# Altium project ShinStrap_V1.PrjPcb
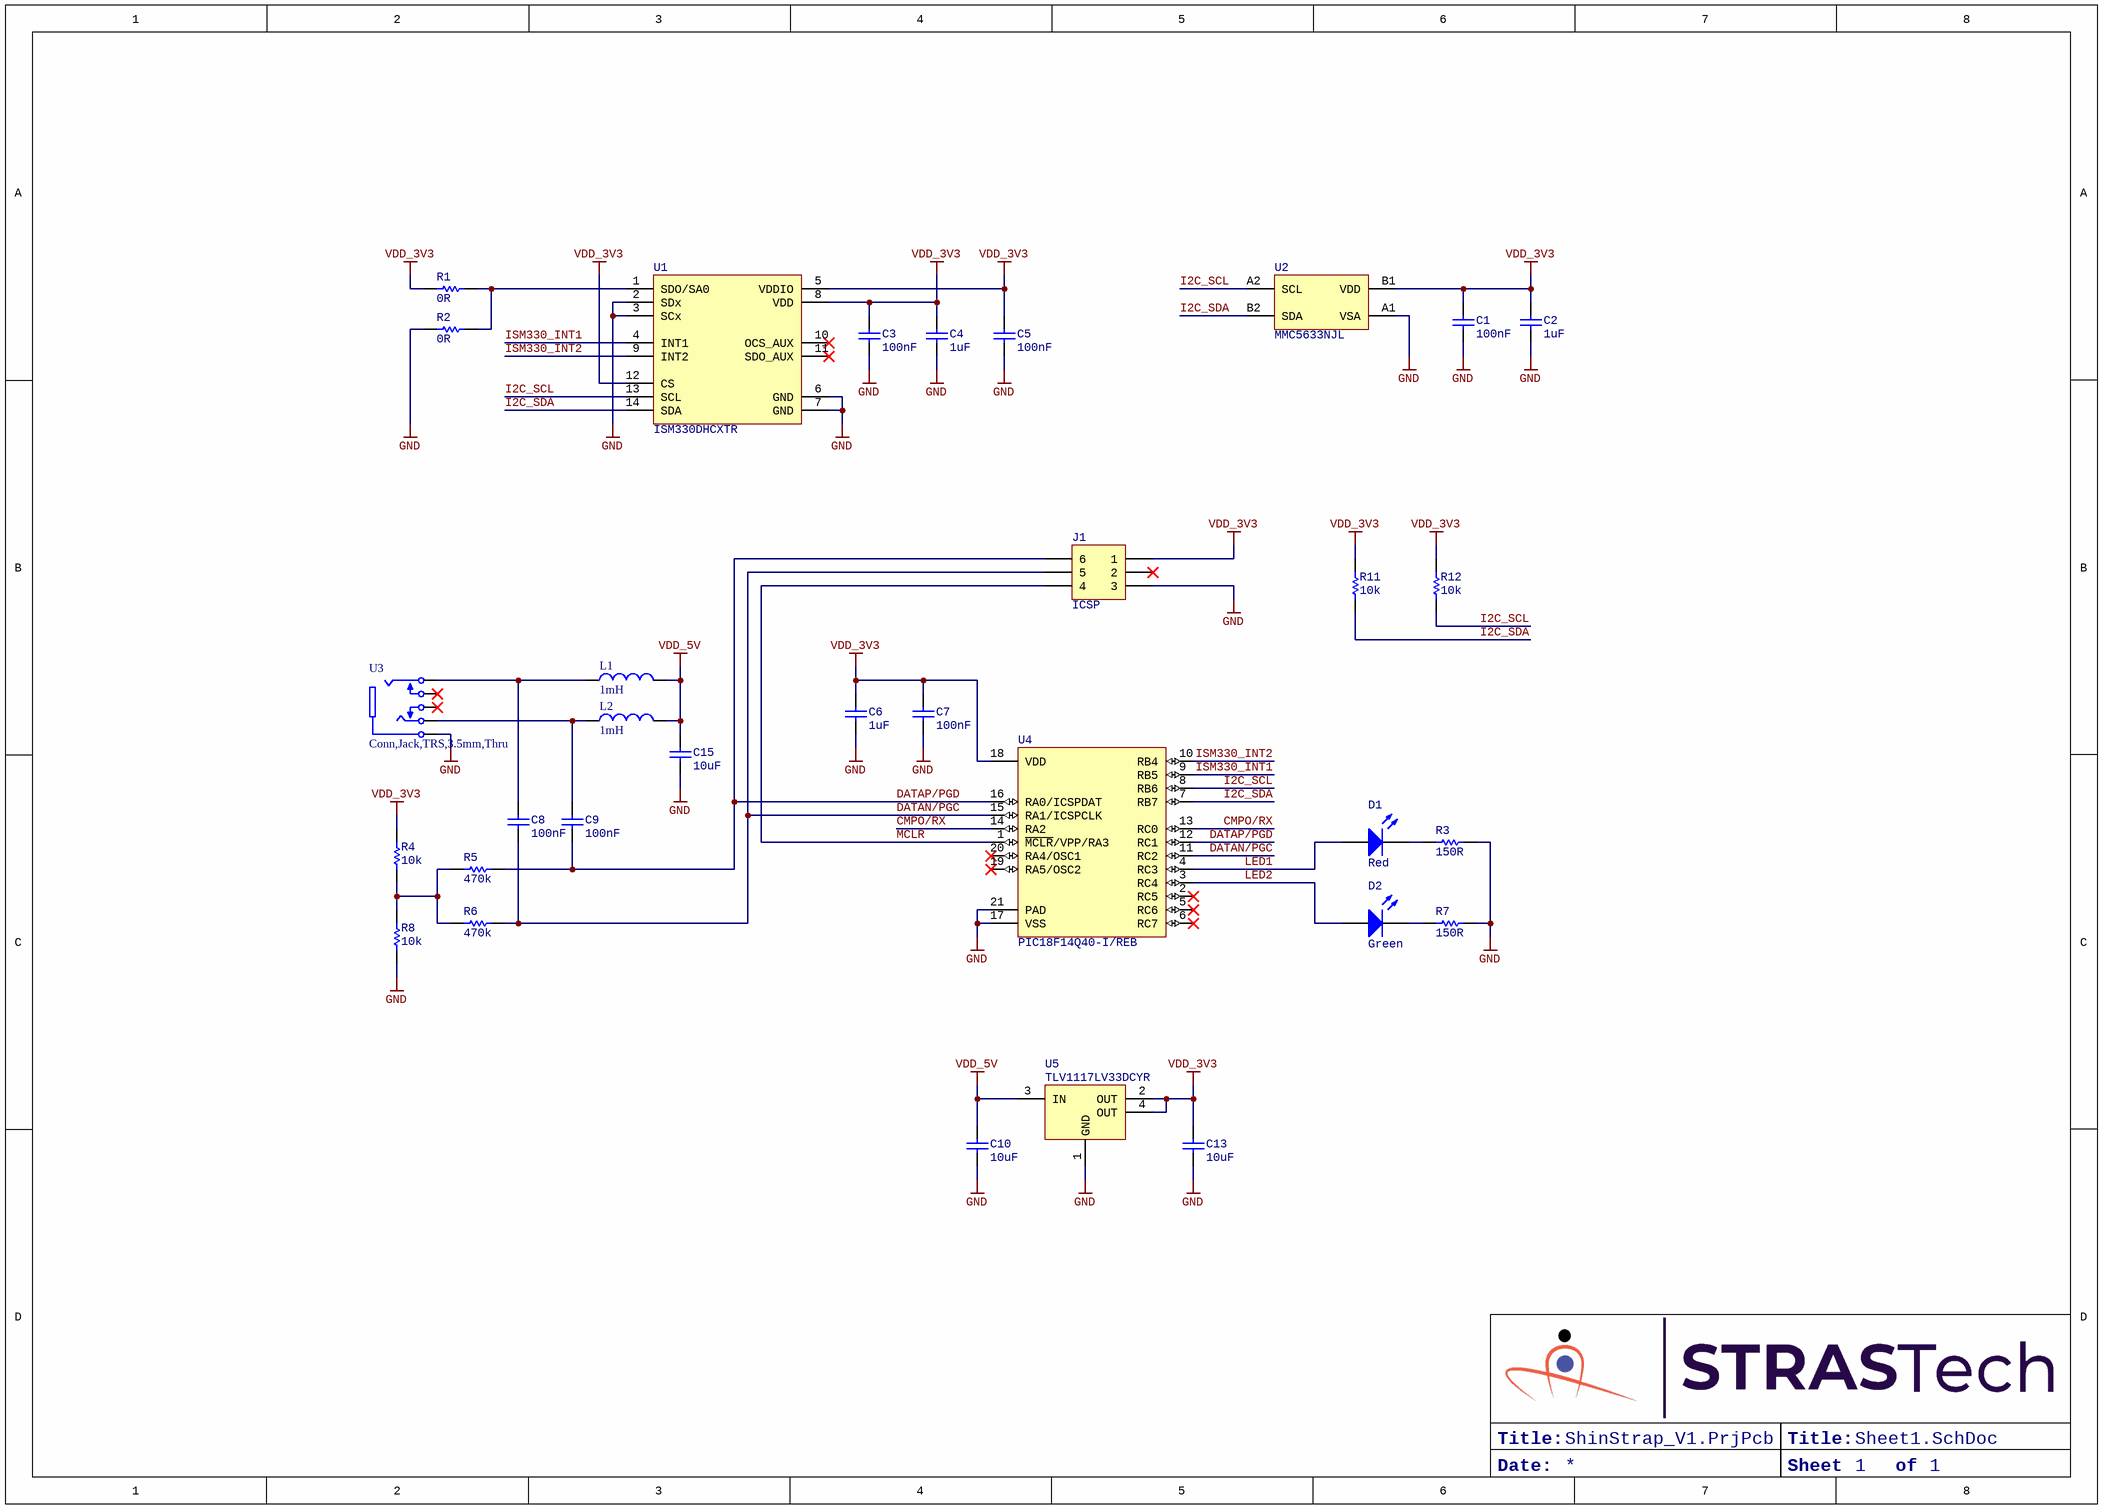
[diagram p0: Sheet1.SchDoc]
1 sheet, 32 parts. Net scope: global (net labels, ports and power ports of the same name join across sheets).
Board file: PCB1.PcbDoc

## Sheet Sheet1.SchDoc
size A3; Organization: Altium Limited; Address1: L3, 12a Rodborough Rd; Address2: Frenchs Forest; Address3: NSW; Address4: Australia 2086; SheetNumber: 1; SheetTotal: 1

### Parts
C1  100nF  [Cap,SMD,0402]
C2  1uF  [Cap,SMD,0402]
C3  100nF  [Cap,SMD,0402]
C4  1uF  [Cap,SMD,0402]
C5  100nF  [Cap,SMD,0402]
C6  1uF  [Cap,SMD,0402]
C7  100nF  [Cap,SMD,0402]
C8  100nF  [Cap,SMD,0402]
C9  100nF  [Cap,SMD,0402]
C10  10uF  [Cap,SMD,0402]
C13  10uF  [Cap,SMD,0402]
C15  10uF  [Cap,SMD,0402]
D1  Red  [LED,0603]
D2  Green  [LED,0603]
J1  Term,Header,3x2 Pin,1.27mm,SMD  [TERM,HEADER,3X2PIN,P1.27,SMD]  (value not drawn)
L1  1mH  [IND,1210]
L2  1mH  [IND,1210]
R1  0R  [RES,0402]
R2  0R  [RES,0402]
R3  150R  [RES,0402]
R4  10k  [RES,0402]
R5  470k  [RES,0402]
R6  470k  [RES,0402]
R7  150R  [RES,0402]
R8  10k  [RES,0402]
R11  10k  [RES,0402]
R12  10k  [RES,0402]
U1  ISM330DHCXTR  [IC,LGA-14L,2.5x3mm]
U2  MMC5633NJL  [IC,WLP,2x2,P0.4mm]
U3  Conn,Jack,TRS,3.5mm,Thru  [CONN,JACK,TRS,3.5MM,THRU]
U4  PIC18F14Q40-I/REB  [IC,QFN-20,3x3,PAD,P0.4]
U5  TLV1117LV33DCYR  [SOT223]

### Nets
GND: C1.2 C2.1 C3.1 C4.1 C5.1 C6.1 C7.1 C10.1 C13.1 C15.1 J1.3 R2.1 R3.2 R7.2 R8.1 U1.2(SDx) U1.3(SCx) U1.6(GND) U1.7(GND) U2.A1(VSA) U3.1(S) U4.17(VSS) U4.21(PAD) U5.1(GND)
VDD_3V3: C1.1 C2.2 C3.2 C4.2 C5.2 C6.2 C7.2 C13.2 J1.1 R1.1 R4.2 R11.2 R12.2 U1.5(VDDIO) U1.8(VDD) U1.12(CS) U2.B1(VDD) U4.18(VDD) U5.2(OUT) U5.4(OUT)
VDD_5V: C10.2 C15.2 L1.2 L2.2 U5.3(IN)
CMPO/RX: U4.13(RC0) U4.14(RA2)
DATAN/PGC: C8.1 J1.5 R6.1 U4.11(RC2) U4.15(RA1/ICSPCLK)
DATAP/PGD: C9.1 J1.6 R5.1 U4.12(RC1) U4.16(RA0/ICSPDAT)
I2C_SCL: R12.1 U1.13(SCL) U2.A2(SCL) U4.8(RB6)
I2C_SDA: R11.1 U1.14(SDA) U2.B2(SDA) U4.7(RB7)
ISM330_INT1: U1.4(INT1) U4.9(RB5)
ISM330_INT2: U1.9(INT2) U4.10(RB4)
LED1: D1.1(A) U4.4(RC3)
LED2: D2.1(A) U4.3(RC4)
~{MCLR}: J1.4 U4.1(~{MCLR}/VPP/RA3)
NetC8_2: C8.2 L1.1 U3.3(R)
NetC9_2: C9.2 L2.1 U3.2(T)
NetD1_2: D1.2(K) R3.1
NetD2_2: D2.2(K) R7.1
NetR1_2: R1.2 R2.2 U1.1(SDO/SA0)
NetR4_1: R4.1 R5.2 R6.2 R8.2

Not connected (* = marked no-connect by the designer): J1 2*; U1 10(OCS_AUX)* 11(SDO_AUX)*; U3 10(TS)* 11(RS)*; U4 2(RC5)* 5(RC6)* 6(RC7)* 19(RA5/OSC2)* 20(RA4/OSC1)*

### Notes on the sheet
- (near J1) ICSP
- Title:
- Date:
- Sheet
- of
- Title
- Size:
- A3
- Revision:
- Design By:

### Library data of the parts
C1 C3 C5 C7-C9 = CAP,Cer,100nF,25VDC,X7R,0402: 0.1µF ±10% 25V Ceramic Capacitor X7R 0402 (1005 Metric); Vendor Part Number: 490-14603-1-ND; Manufacturer: Murata Electronics; Manufacturer Part Number: GRM155R71E104KE14J; Vendor: Digikey; HelpURL: https://search.murata.co.jp/Ceramy/image/img/A01X/G101/ENG/GRM155R71E104KE14-01.pdf; CreatedBy: Judd Foster
C2 C4 C6 = CAP,Cer,1uF,35VDC,X5R,0402: 1 µF ±10% 35V Ceramic Capacitor X5R 0402 (1005 Metric); Vendor Part Number: 445-9073-1-ND; Manufacturer: TDK Corporation; Manufacturer Part Number: C1005X5R1V105K050BC; Vendor: Digikey; HelpURL: https://product.tdk.com/info/en/catalog/datasheets/mlcc_commercial_general_en.pdf?ref_disty=digikey; CreatedBy: Judd Foster
C10 C13 C15 = CAP,Cer,10uF,10VDC,X5R,0402: 10 µF ±20% 10V Ceramic Capacitor X5R 0402 (1005 Metric); Vendor Part Number: 1276-1450-1-ND; Manufacturer: Samsung Electro-Mechanics; Manufacturer Part Number: CL05A106MP5NUNC; Vendor: Digikey; HelpURL: https://media.digikey.com/pdf/Data%20Sheets/Samsung%20PDFs/CL05A106MP5NUNC_Spec.pdf; CreatedBy: Judd Foster
D1 = LED,Red,SMD,0603: Red 633nm LED Indication - Discrete 2V 0603 (1608 Metric); Manufacturer: Lite-On Inc.; Manufacturer Part Number: LS Q976-NR-1; Vendor Part Number: 475-2512-1-ND; Vendor: Digikey; CreatedBy: Judd Foster; HelpURL: https://dammedia.osram.info/media/resource/hires/osram-dam-2493499/LS%20Q976.pdf
D2 = LED,Green,SMD,0603: Green 530nm LED Indication - Discrete 3V 0603 (1608 Metric); Manufacturer: Stanley Electric Co; Manufacturer Part Number: THG1111C-0005-TR; Vendor Part Number: 404-1286-1-ND; Vendor: Digikey; CreatedBy: Judd Foster; HelpURL: http://www.stanley-components.com/php/downloaddatafile.php?rp=0,THG1111C-0005_e.pdf
J1 = Term,Header,3x2 Pin,1.27mm,SMD: Connector Header Surface Mount 6 position 0.050" (1.27mm); Vendor Part Number: 609-3693-1-ND; Manufacturer: Amphenol ICC (FCI); Manufacturer Part Number: 20021121-00006C4LF; Vendor: Digikey; HelpURL: https://media.digikey.com/pdf/Data%20Sheets/FCI%20PDFs/Minitek%20127_Catalog.pdf; CreatedBy: Judd Foster
L1 L2 = IND,1mH,100mA,Wirewound,1210: 1 mH Unshielded Wirewound Inductor 100 mA 16.9Ohm Max 1210 (3225 Metric); Vendor Part Number: 587-CBC3225T102MRCT-ND; Manufacturer: Taiyo Yuden; Manufacturer Part Number: CBC3225T102MR; Vendor: Digikey; HelpURL: https://ds.yuden.co.jp/TYCOMPAS/ut/detail?pn=CBC3225T102MR%20&u=M; CreatedBy: Judd Foster
R1 R2 = RES,0R0,0.1W,0402: 0 Ohms Jumper 0.1W, 1/10W Chip Resistor 0402 (1005 Metric) Automotive AEC-Q200 Thick Film; Manufacturer: Panasonic Electronic Components; Manufacturer Part Number: ERJ-2GE0R00X; Vendor Part Number: P0.0JCT-ND; Vendor: Digikey; CreatedBy: Judd Foster; HelpURL: https://industrial.panasonic.com/cdbs/www-data/pdf/RDA0000/AOA0000C301.pdf
R3 R7 = RES,150R,1%,0.1W,0402: 150 Ohms ±1% 0.063W, 1/16W Chip Resistor 0402 (1005 Metric) Automotive AEC-Q200, Moisture Resistant Thick Film; Manufacturer: TE Connectivity Passive Product; Manufacturer Part Number: CRGCQ0402F150R; Vendor Part Number: A129617CT-ND; Vendor: Digikey; CreatedBy: Judd Foster; HelpURL: https://www.te.com/commerce/DocumentDelivery/DDEController?Action=srchrtrv&DocNm=1773204-3&DocType=DS&DocLang=English
R4 R8 R11 R12 = RES,10k,5%,0.063W,0402: 10 kOhms ±5% 0.063W, 1/16W Chip Resistor 0402 (1005 Metric) Automotive AEC-Q200 Thick Film; Vendor Part Number: RMCF0402JT10K0CT-ND; Manufacturer: Stackpole Electronics Inc; Manufacturer Part Number: RMCF0402JT10K0; Vendor: DIgikey; HelpURL: https://www.seielect.com/catalog/sei-rmcf_rmcp.pdf; CreatedBy: Judd Foster
R5 R6 = RES,470k,5%,0.063W,0402: 470 kOhms ±5% 0.063W, 1/16W Chip Resistor 0402 (1005 Metric) Automotive AEC-Q200 Thick Film; Manufacturer: Stackpole Electronics Inc; Manufacturer Part Number: RMCF0402JT470K; Vendor Part Number: RMCF0402JT470KCT-ND; Vendor: Digikey; CreatedBy: Judd Foster; HelpURL: https://www.seielect.com/catalog/sei-rmcf_rmcp.pdf
U1 = ISM330DHCXTR: Accelerometer, Gyroscope, Temperature, 6 Axis Sensor I²C, SPI Output; Manufacturer: STMicroelectronics; Vendor Part Number: 497-19784-1-ND; Vendor: Digikey; CreatedBy: Judd Foster; HelpURL: https://www.st.com/resource/en/datasheet/ism330dhcx.pdf; Manufacturer Part Number: ISM330DHCXTR
U2 = MMC5633NJL: Magnetoresistive Sensor X, Y, Z Axis 4-WLP (0.85x0.85); Manufacturer: Memsic Inc.; Vendor Part Number: 1267-MMC5633NJLCT-ND; Vendor: Digikey; CreatedBy: Judd Foster; HelpURL: https://media.digikey.com/pdf/Data%20Sheets/MEMSIC%20PDFs/MMC5633NJL_RevA_3-12-20.pdf; Manufacturer Part Number: MMC5633NJL
U3 = Conn,Jack,TRS,3.5mm,Thru: 3.50mm (0.141", 1/8", Mini Plug) - Headphone Phone Jack Stereo (3 Conductor, TRS) Connector Solder; Manufacturer: CUI Devices; Manufacturer Part Number: SJ1-3525N; Vendor Part Number: CP1-3525N-ND; Vendor: Digikey; CreatedBy: Judd Foster; HelpURL: https://www.cuidevices.com/product/resource/sj1-352xn.pdf
U4 = PIC18F14Q40-I/REB: PIC series Microcontroller IC 8-Bit 64MHz 16KB (16K x 8) FLASH 20-VQFN (3x3); Manufacturer: Microchip Technology; Vendor Part Number: 150-PIC18F14Q40-I/REB-ND; Vendor: Digikey; CreatedBy: Judd Foster; HelpURL: https://ww1.microchip.com/downloads/en/DeviceDoc/PIC18F04-05-14-15-Q40-1420-Pin-Low-Power-High-Performance-Microcontroller-With-XLP-Technology-Data-Sheet-40002236B.pdf; Manufacturer Part Number: PIC18F14Q40-I/REB
U5 = TLV1117LV33DCYR: Linear Voltage Regulator IC  1 Output  1A SOT-223-4; Manufacturer: Texas Instruments; Vendor Part Number: 296-28778-1-ND; Vendor: Digikey; CreatedBy: Judd Foster; HelpURL: http://www.ti.com/lit/ds/symlink/tlv1117lv.pdf; Manufacturer Part Number: TLV1117LV33DCYR